# Altium project Main Board.PrjPcb
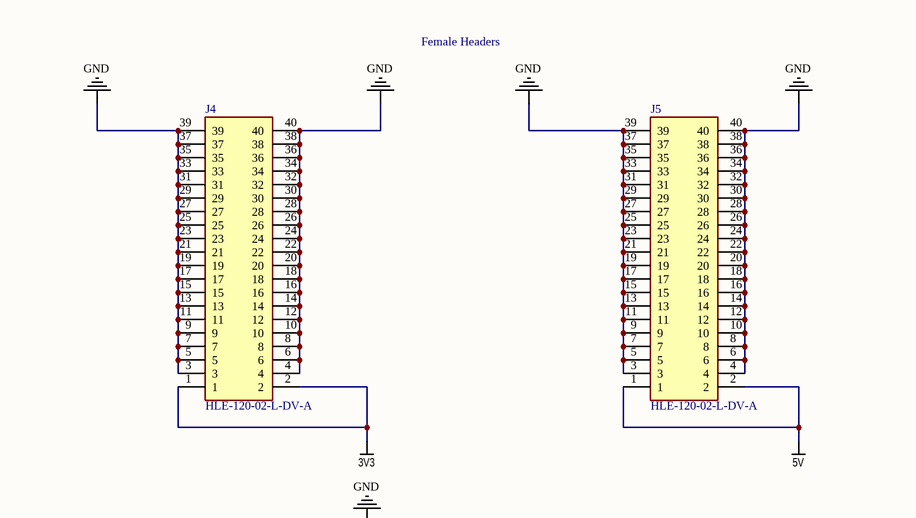
[diagram p0: MainBoard.SchDoc, top left]
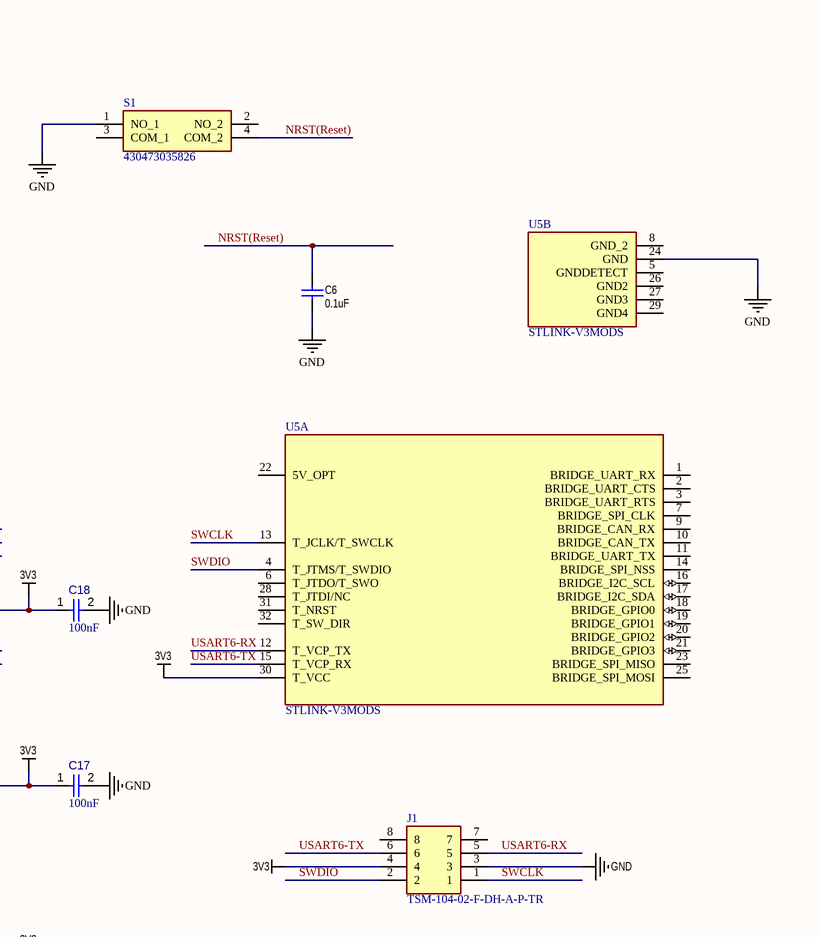
[diagram p1: MainBoard.SchDoc, top right]
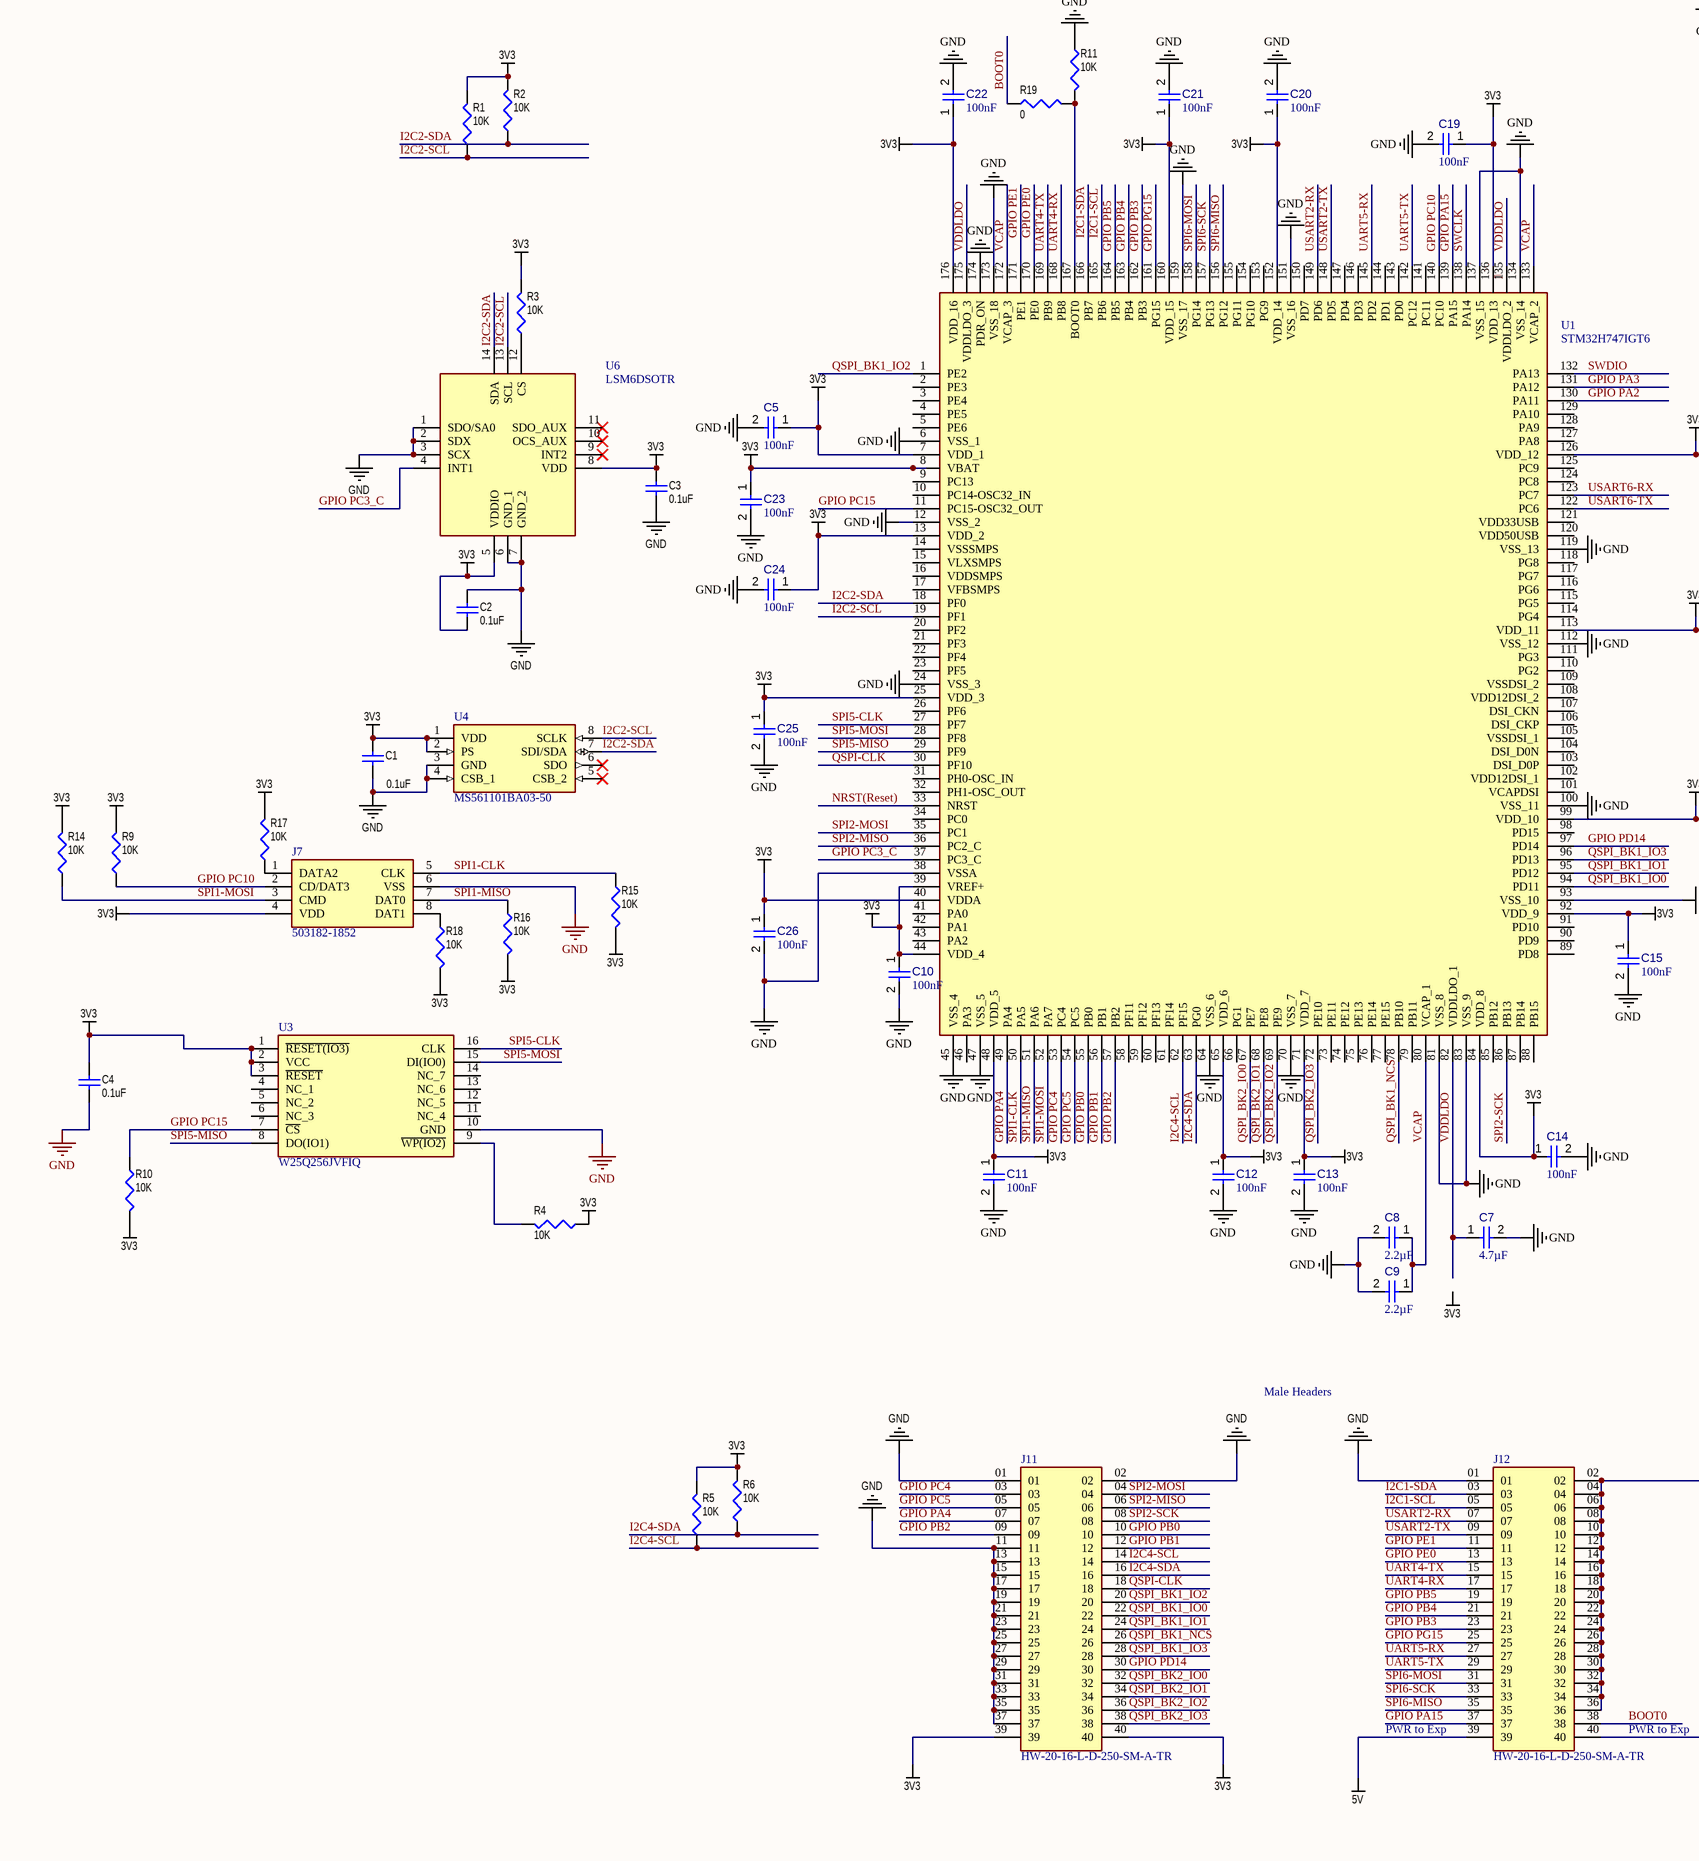
[diagram p2: MainBoard.SchDoc, bottom left]
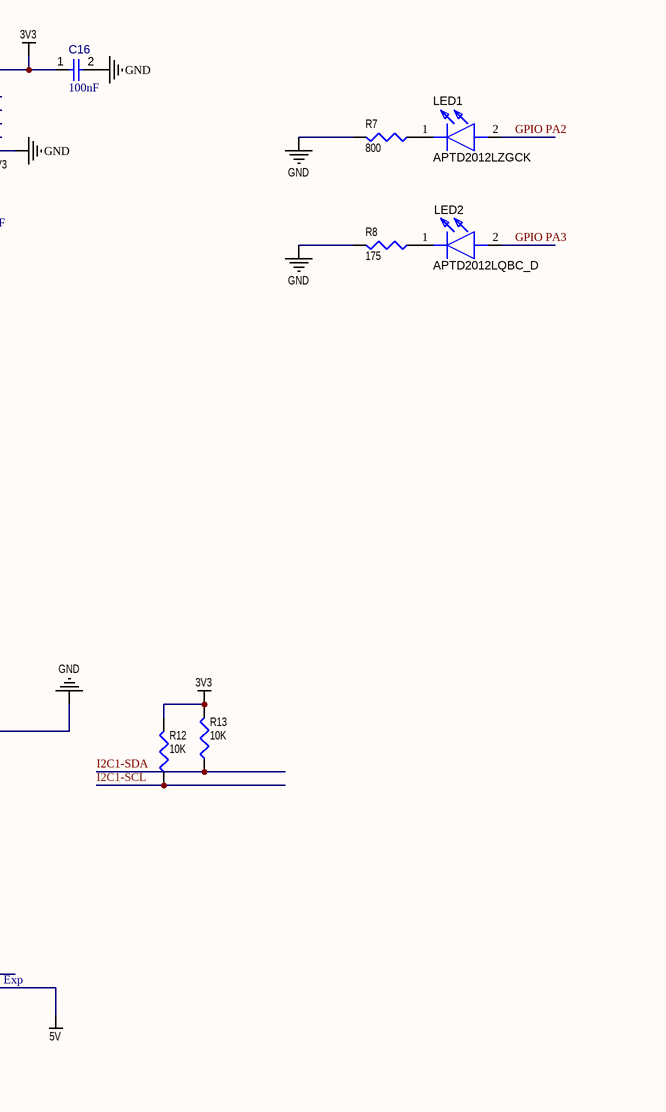
[diagram p3: MainBoard.SchDoc, bottom right]
1 sheet, 59 parts. Net scope: global (net labels, ports and power ports of the same name join across sheets).
Board file: MainBoardCurrent.PcbDoc

## Sheet MainBoard.SchDoc
size D; SheetNumber: 1; SheetTotal: 1

### Parts
C1  0.1uF  [1608[0603]]
C2  0.1uF  [1608[0603]]
C3  0.1uF  [1608[0603]]
C4  0.1uF  [1608[0603]]
C5  value 100nF  [CAPC0402(1005)60_L]  (hidden comment: Capacitor 100nF +/-20% 25V 0402)
C6  0.1uF  [1608[0603]]
C7  value 4.7µF  [CAPC0805(2012)145_L]  (hidden comment: Capacitor 4.7µF +/-40% 25V 0805)
C8  value 2.2µF  [CAPC0402(1005)60_L]  (hidden comment: Capacitor 2,2µF +/-20% 10V 0402)
C9  value 2.2µF  [CAPC0402(1005)60_L]  (hidden comment: Capacitor 2,2µF +/-20% 10V 0402)
C10  value 100nF  [CAPC0402(1005)60_L]  (hidden comment: Capacitor 100nF +/-20% 25V 0402)
C11  value 100nF  [CAPC0402(1005)60_L]  (hidden comment: Capacitor 100nF +/-20% 25V 0402)
C12  value 100nF  [CAPC0402(1005)60_L]  (hidden comment: Capacitor 100nF +/-20% 25V 0402)
C13  value 100nF  [CAPC0402(1005)60_L]  (hidden comment: Capacitor 100nF +/-20% 25V 0402)
C14  value 100nF  [CAPC0402(1005)60_L]  (hidden comment: Capacitor 100nF +/-20% 25V 0402)
C15  value 100nF  [CAPC0402(1005)60_L]  (hidden comment: Capacitor 100nF +/-20% 25V 0402)
C16  value 100nF  [CAPC0402(1005)60_L]  (hidden comment: Capacitor 100nF +/-20% 25V 0402)
C17  value 100nF  [CAPC0402(1005)60_L]  (hidden comment: Capacitor 100nF +/-20% 25V 0402)
C18  value 100nF  [CAPC0402(1005)60_L]  (hidden comment: Capacitor 100nF +/-20% 25V 0402)
C19  value 100nF  [CAPC0402(1005)60_L]  (hidden comment: Capacitor 100nF +/-20% 25V 0402)
C20  value 100nF  [CAPC0402(1005)60_L]  (hidden comment: Capacitor 100nF +/-20% 25V 0402)
C21  value 100nF  [CAPC0402(1005)60_L]  (hidden comment: Capacitor 100nF +/-20% 25V 0402)
C22  value 100nF  [CAPC0402(1005)60_L]  (hidden comment: Capacitor 100nF +/-20% 25V 0402)
C23  value 100nF  [CAPC0402(1005)60_L]  (hidden comment: Capacitor 100nF +/-20% 25V 0402)
C24  value 100nF  [CAPC0402(1005)60_L]  (hidden comment: Capacitor 100nF +/-20% 25V 0402)
C25  value 100nF  [CAPC0402(1005)60_L]  (hidden comment: Capacitor 100nF +/-20% 25V 0402)
C26  value 100nF  [CAPC0402(1005)60_L]  (hidden comment: Capacitor 100nF +/-20% 25V 0402)
J1  TSM-104-02-F-DH-A-P-TR  [TSM-104-ZZ-YYY-DH-A-P-TR]
J4  HLE-120-02-L-DV-A  [HLE-120-02-XXX-DV-A]
J5  HLE-120-02-L-DV-A  [HLE-120-02-XXX-DV-A]
J7  503182-1852  [5031821852]
J11  HW-20-16-L-D-250-SM-A-TR  [SAMTEC_HW-20-16-L-D-250-SM-A-TR]
J12  HW-20-16-L-D-250-SM-A-TR  [SAMTEC_HW-20-16-L-D-250-SM-A-TR]
LED1  APTD2012LZGCK  [FIL_0805J0500471MATE03]
LED2  APTD2012LQBC_D  [FIL_0805J0500471MATE03]
R1  10K  [J1-0603]
R2  10K  [J1-0603]
R3  10K  [J1-0603]
R4  10K  [J1-0603]
R5  10K  [J1-0603]
R6  10K  [J1-0603]
R7  800  [RES_ERJU03F6800V]
R8  175  [RES_ERJU03F6800V]
R9  10K  [J1-0603]
R10  10K  [J1-0603]
R11  10K  [J1-0603]
R12  10K  [J1-0603]
R13  10K  [J1-0603]
R14  10K  [J1-0603]
R15  10K  [J1-0603]
R16  10K  [J1-0603]
R17  10K  [J1-0603]
R18  10K  [J1-0603]
R19  0  [J1-0603]
S1  430473035826  [430473035826]
U1  STM32H747IGT6  [QFP50P2600X2600X160-176N]
U3  W25Q256JVFIQ  [SOIC127P1032X264-16N]
U4  MS561101BA03-50  [MS561101BA03-50]
U5  STLINK-V3MODS  [MODULE_STLINK-V3MODS]  (parts A,B of 2)
U6  LSM6DSOTR  [LGA-14(2.5X3X0.86)]

### Nets
3V3: C1.2 C2.1 C3.2 C4.2 C5.1 C10.1 C11.1 C12.1 C13.1 C14.1 C15.1 C16.1 C17.1 C18.1 C19.1 C20.1 C21.1 C22.1 C23.1 C24.1 C25.1 C26.1 J1.4 J4.1 J4.2 J7.4(VDD) J11.39 J11.40 R1.2 R2.2 R3.2 R4.1 R5.2 R6.2 R9.2 R10.2 R12.2 R13.2 R14.2 R15.2 R16.2 R17.2 R18.2 U1.7(VDD_1) U1.8(VBAT) U1.13(VDD_2) U1.25(VDD_3) U1.39(VREF+) U1.40(VDDA) U1.44(VDD_4) U1.48(VDD_5) U1.65(VDD_6) U1.71(VDD_7) U1.84(VDD_8) U1.92(VDD_9) U1.99(VDD_10) U1.113(VDD_11) U1.126(VDD_12) U1.136(VDD_13) U1.152(VDD_14) U1.160(VDD_15) U1.176(VDD_16) U3.1(~{RESET(IO3)}) U3.2(VCC) U3.3(~{RESET}) U4.1(VDD) U4.2(PS) U5.30(T_VCC) U6.5(VDDIO) U6.8(VDD)
5V: J5.1 J5.2 J12.39 J12.40
GND: C1.1 C2.2 C3.1 C4.1 C5.2 C6.1 C7.2 C8.2 C9.2 C10.2 C11.2 C12.2 C13.2 C14.2 C15.2 C16.2 C17.2 C18.2 C19.2 C20.2 C21.2 C22.2 C23.2 C24.2 C25.2 C26.2 J1.3 J4.3 J4.4 J4.5 J4.6 J4.7 J4.8 J4.9 J4.10 J4.11 J4.12 J4.13 J4.14 J4.15 J4.16 J4.17 J4.18 J4.19 J4.20 J4.21 J4.22 J4.23 J4.24 J4.25 J4.26 J4.27 J4.28 J4.29 J4.30 J4.31 J4.32 J4.33 J4.34 J4.35 J4.36 J4.37 J4.38 J4.39 J4.40 J5.3 J5.4 J5.5 J5.6 J5.7 J5.8 J5.9 J5.10 J5.11 J5.12 J5.13 J5.14 J5.15 J5.16 J5.17 J5.18 J5.19 J5.20 J5.21 J5.22 J5.23 J5.24 J5.25 J5.26 J5.27 J5.28 J5.29 J5.30 J5.31 J5.32 J5.33 J5.34 J5.35 J5.36 J5.37 J5.38 J5.39 J5.40 J7.6(VSS) J11.01 J11.02 J11.11 J11.13 J11.15 J11.17 J11.19 J11.21 J11.23 J11.25 J11.27 J11.29 J11.31 J11.33 J11.35 J11.37 J12.01 J12.02 J12.04 J12.06 J12.08 J12.10 J12.12 J12.14 J12.16 J12.18 J12.20 J12.22 J12.24 J12.26 J12.28 J12.30 J12.32 J12.34 J12.36 R7.2 R8.2 R11.1 S1.1(NO_1) U1.6(VSS_1) U1.12(VSS_2) U1.24(VSS_3) U1.38(VSSA) U1.45(VSS_4) U1.47(VSS_5) U1.64(VSS_6) U1.70(VSS_7) U1.81(VSS_8) U1.83(VSS_9) U1.93(VSS_10) U1.100(VSS_11) U1.112(VSS_12) U1.119(VSS_13) U1.134(VSS_14) U1.137(VSS_15) U1.151(VSS_16) U1.159(VSS_17) U1.173(VSS_18) U1.174(PDR_ON) U3.10(GND) U4.3(GND) U4.4(CSB_1) U5.24(GND) U6.1(SDO/SA0) U6.2(SDX) U6.3(SCX) U6.6(GND_1) U6.7(GND_2)
BOOT0: J12.38 R19.1
GPIO PA2: LED1.2(A) U1.130(PA11)
GPIO PA3: LED2.2(A) U1.131(PA12)
GPIO PA4: J11.07 U1.49(PA4)
GPIO PA15: J12.37 U1.139(PA15)
GPIO PB0: J11.10 U1.55(PB0)
GPIO PB1: J11.12 U1.56(PB1)
GPIO PB2: J11.09 U1.57(PB2)
GPIO PB3: J12.23 U1.162(PB3)
GPIO PB4: J12.21 U1.163(PB4)
GPIO PB5: J12.19 U1.164(PB5)
GPIO PC3_C: U1.37(PC3_C) U6.4(INT1)
GPIO PC4: J11.03 U1.53(PC4)
GPIO PC5: J11.05 U1.54(PC5)
GPIO PC10: J7.2(CD/DAT3) R9.1 U1.140(PC10)
GPIO PC15: R10.1 U1.11(PC15-OSC32_OUT) U3.7(~{CS})
GPIO PD14: J11.30 U1.97(PD14)
GPIO PE0: J12.13 U1.170(PE0)
GPIO PE1: J12.11 U1.171(PE1)
GPIO PG15: J12.25 U1.161(PG15)
I2C1-SCL: J12.05 R12.1 U1.165(PB6)
I2C1-SDA: J12.03 R13.1 U1.166(PB7)
I2C2-SCL: R1.1 U1.19(PF1) U4.8(SCLK) U6.13(SCL)
I2C2-SDA: R2.1 U1.18(PF0) U4.7(SDI/SDA) U6.14(SDA)
I2C4-SCL: J11.14 R5.1 U1.62(PF15)
I2C4-SDA: J11.16 R6.1 U1.63(PG0)
NRST(Reset): C6.2 S1.4(COM_2) U1.33(NRST)
QSPI-CLK: J11.18 U1.30(PF10)
QSPI_BK1_IO0: J11.22 U1.94(PD11)
QSPI_BK1_IO1: J11.24 U1.95(PD12)
QSPI_BK1_IO2: J11.20 U1.1(PE2)
QSPI_BK1_IO3: J11.28 U1.96(PD13)
QSPI_BK1_NCS: J11.26 U1.78(PB10)
QSPI_BK2_IO0: J11.32 U1.67(PE7)
QSPI_BK2_IO1: J11.34 U1.68(PE8)
QSPI_BK2_IO2: J11.36 U1.69(PE9)
QSPI_BK2_IO3: J11.38 U1.72(PE10)
SPI1-CLK: J7.5(CLK) R15.1 U1.50(PA5)
SPI1-MISO: J7.7(DAT0) R16.1 U1.51(PA6)
SPI1-MOSI: J7.3(CMD) R14.1 U1.52(PA7)
SPI2-MISO: J11.06 U1.36(PC2_C)
SPI2-MOSI: J11.04 U1.35(PC1)
SPI2-SCK: J11.08 U1.86(PB13)
SPI5-CLK: U1.27(PF7) U3.16(CLK)
SPI5-MISO: U1.29(PF9) U3.8(DO(IO1))
SPI5-MOSI: U1.28(PF8) U3.15(DI(IO0))
SPI6-MISO: J12.35 U1.156(PG12)
SPI6-MOSI: J12.31 U1.158(PG14)
SPI6-SCK: J12.33 U1.157(PG13)
SWCLK: J1.1 U1.138(PA14) U5.13(T_JCLK/T_SWCLK)
SWDIO: J1.2 U1.132(PA13) U5.4(T_JTMS/T_SWDIO)
UART4-RX: J12.17 U1.168(PB8)
UART4-TX: J12.15 U1.169(PB9)
UART5-RX: J12.27 U1.145(PD2)
UART5-TX: J12.29 U1.142(PC12)
USART2-RX: J12.07 U1.149(PD6)
USART2-TX: J12.09 U1.148(PD5)
USART6-RX: J1.5 U1.123(PC7) U5.12(T_VCP_TX)
USART6-TX: J1.6 U1.122(PC6) U5.15(T_VCP_RX)
VCAP: C8.1 C9.1 U1.80(VCAP_1) U1.133(VCAP_2) U1.172(VCAP_3)
VDDLDO: C7.1 U1.82(VDDLDO_1) U1.135(VDDLDO_2) U1.175(VDDLDO_3)
NetJ7_1: J7.1(DATA2) R17.1
NetJ7_8: J7.8(DAT1) R18.1
NetLED1_1: LED1.1(K) R7.1
NetLED2_1: LED2.1(K) R8.1
NetR3_1: R3.1 U6.12(CS)
NetR4_2: R4.2 U3.9(~{WP(IO2)})
NetR11_2: R11.2 R19.2 U1.167(BOOT0)

Not connected (* = marked no-connect by the designer): J1 7 8; S1 2(NO_2) 3(COM_1); U1 2(PE3) 3(PE4) 4(PE5) 5(PE6) 9(PC13) 10(PC14-OSC32_IN) 14(VSSSMPS) 15(VLXSMPS) 16(VDDSMPS) 17(VFBSMPS) 20(PF2) 21(PF3) 22(PF4) 23(PF5) 26(PF6) 31(PH0-OSC_IN) 32(PH1-OSC_OUT) 34(PC0) 41(PA0) 42(PA1) 43(PA2) 46(PA3) 58(PF11) 59(PF12) 60(PF13) 61(PF14) 66(PG1) 73(PE11) 74(PE12) 75(PE13) 76(PE14) 77(PE15) 79(PB11) 85(PB12) 87(PB14) 88(PB15) 89(PD8) 90(PD9) 91(PD10) 98(PD15) 101(VCAPDSI) 102(VDD12DSI_1) 103(DSI_D0P) 104(DSI_D0N) 105(VSSDSI_1) 106(DSI_CKP) 107(DSI_CKN) 108(VDD12DSI_2) 109(VSSDSI_2) 110(PG2) 111(PG3) 114(PG4) 115(PG5) 116(PG6) 117(PG7) 118(PG8) 120(VDD50USB) 121(VDD33USB) 124(PC8) 125(PC9) 127(PA8) 128(PA9) 129(PA10) 141(PC11) 143(PD0) 144(PD1) 146(PD3) 147(PD4) 150(PD7) 153(PG9) 154(PG10) 155(PG11); U3 4(NC_1) 5(NC_2) 6(NC_3) 11(NC_4) 12(NC_5) 13(NC_6) 14(NC_7); U4 5(CSB_2)* 6(SDO)*; U5 1(BRIDGE_UART_RX) 2(BRIDGE_UART_CTS) 3(BRIDGE_UART_RTS) 5(GNDDETECT) 6(T_JTDO/T_SWO) 7(BRIDGE_SPI_CLK) 8(GND_2) 9(BRIDGE_CAN_RX) 10(BRIDGE_CAN_TX) 11(BRIDGE_UART_TX) 14(BRIDGE_SPI_NSS) 16(BRIDGE_I2C_SCL) 17(BRIDGE_I2C_SDA) 18(BRIDGE_GPIO0) 19(BRIDGE_GPIO1) 20(BRIDGE_GPIO2) 21(BRIDGE_GPIO3) 22(5V_OPT) 23(BRIDGE_SPI_MISO) 25(BRIDGE_SPI_MOSI) 26(GND2) 27(GND3) 28(T_JTDI/NC) 29(GND4) 31(T_NRST) 32(T_SW_DIR); U6 9(INT2)* 10(OCS_AUX)* 11(SDO_AUX)*

### Notes on the sheet
- Female Headers
- Male Headers
- (near J12) PWR to Exp
- PWR to Exp
- Labels drawn without touching a wire or pin: 3V3, 

### Library data of the parts
C1-C4 C6 = Cap: Capacitor; Published: 8-Jun-2000; LatestRevisionDate: 17-Jul-2002; LatestRevisionNote: Re-released for DXP Platform.; PackageReference: RAD-0.3; Publisher: Altium Limited; PackageDescription: Radial Cap, Thru-Hole; 2 Leads; 0.3 in Pin Spacing; Value: 0.1uF
C5 C10-C26 = CMP-001-00065-4: Chip Capacitor, 100nF +/-20%, 25V, 0402, Thickness 0.6 mm; Tolerance: 10%; Max Operating Temperature: 85°C; Min Operating Temperature: -55°C; Pins: 2; Voltage Rating: 25V; Mounting Technology: SMT; Case/Package: 0402
C7 = CMP-001-00080-4: Chip Capacitor, 4.7µF +/-40%, 25V, 0805, Thickness 1.45 mm; Tolerance: 20%; Voltage Rating: 25V; Min Operating Temperature: -55°C; Max Operating Temperature: 85°C; Pins: 2; Mounting Technology: SMT; Case/Package: 0805
C8 C9 = CMP-001-00056-4: Chip Capacitor, 2,2µF +/-20%, 10V, 0402, Thickness 0.6 mm; Tolerance: 10%; Mounting Technology: SMT; Max Operating Temperature: 85°C; Case/Package: 0402; Pins: 2; Min Operating Temperature: -55°C; Voltage Rating: 10V
J1 = TSM-104-02-F-DH-A-P-TR: Connector; Manufacturer_Name: SAMTEC; Datasheet Link: http://suddendocs.samtec.com/prints/tsm-1xx-xx-xxx-xx-xx-xxx-xx-mkt1.pdf; Manufacturer_Part_Number: TSM-104-02-F-DH-A-P-TR
J4 J5 = HLE-120-02-L-DV-A: Connector; Manufacturer_Name: SAMTEC; Datasheet Link: http://suddendocs.samtec.com/prints/hle-1xx-02-xxx-dv-xx-xx-xx-mkt.pdf; Manufacturer_Part_Number: HLE-120-02-L-DV-A; Mouser Part Number: 200-HLE12002LDVA; Mouser Price/Stock: https://www.mouser.co.uk/ProductDetail/Samtec/HLE-120-02-L-DV-A?qs=0lQeLiL1qyZq0rwGrAI%2FeQ%3D%3D; Arrow Part Number: HLE-120-02-L-DV-A; Arrow Price/Stock: https://www.arrow.com/en/products/hle-120-02-l-dv-a/samtec?region=nac
J7 = 503182-1852: Connector; Manufacturer_Name: Molex; Datasheet Link: https://www.molex.com/pdm_docs/sd/5031821852_sd.pdf; Manufacturer_Part_Number: 503182-1852; Mouser Part Number: 538-503182-1852; Mouser Price/Stock: https://www.mouser.co.uk/ProductDetail/Molex/503182-1852?qs=s7UCm7gO1bZmpyAhCKZ26g%3D%3D
LED1 = APTD2012LZGCK: LED; Manufacturer_Name: Kingbright; Datasheet Link: http://www.kingbrightusa.com/images/catalog/SPEC/APTD2012LZGCK.pdf; Height: 1.05mm; Manufacturer_Part_Number: APTD2012LZGCK; Mouser Part Number: 604-APTD2012LZGCK; Mouser Price/Stock: https://www.mouser.co.uk/ProductDetail/Kingbright/APTD2012LZGCK?qs=AQlKX63v8RvUnlqpSGhMeA%3D%3D; Arrow Part Number: APTD2012LZGCK; Arrow Price/Stock: https://www.arrow.com/en/products/aptd2012lzgck/kingbright?region=nac
LED2 = APTD2012LQBC_D: LED; Manufacturer_Name: Kingbright; Manufacturer_Part_Number: APTD2012LQBC/D; Datasheet Link: https://componentsearchengine.com/Datasheets/1/APTD2012LQBC_D.pdf; Height: 1.2mm; Mouser Part Number: 604-APTD2012LQBCD; Mouser Price/Stock: https://www.mouser.co.uk/ProductDetail/Kingbright/APTD2012LQBC-D?qs=AQlKX63v8RvDGqprk6aUCg%3D%3D; Arrow Part Number: APTD2012LQBC/D; Arrow Price/Stock: https://www.arrow.com/en/products/aptd2012lqbcd/kingbright
R1-R19 = Res3: Resistor; Value: 1K; Published: 8-Jun-2000; LatestRevisionDate: 29-May-2009; LatestRevisionNote: IPC-7351 Footprint Added.; PackageReference: J1-0603; Publisher: Altium Limited; PackageDescription: Chip Resistor
S1 = 430473035826: Switch; Manufacturer_Name: Wurth Elektronik; Datasheet Link: https://componentsearchengine.com/Datasheets/2/430473035826.pdf; Height: 3.7mm; Manufacturer_Part_Number: 430473035826; Mouser Part Number: 710-430473035826; Mouser Price/Stock: https://www.mouser.co.uk/ProductDetail/Wurth-Elektronik/430473035826?qs=wr8lucFkNMX7XPiy2wLoYQ%3D%3D
U1 = STM32H747IGT6: ARM Microcontrollers - MCU 16/32-BITS MICROS; Manufacturer_Name: STMicroelectronics; Geometry.Height: 1.6mm; Manufacturer_Part_Number: STM32H747IGT6; Mouser Part Number: 511-STM32H747IGT6; Mouser Price/Stock: https://www.mouser.co.uk/ProductDetail/STMicroelectronics/STM32H747IGT6?qs=%252B6g0mu59x7Kw%252BsPEalqvLg%3D%3D; Arrow Part Number: STM32H747IGT6; Arrow Price/Stock: https://www.arrow.com/en/products/stm32h747igt6/stmicroelectronics?region=nac; Datasheet Link: https://www.mouser.com/datasheet/2/389/dm00602212-1799407.pdf
U3 = W25Q256JVFIQ: Integrated Circuit; Manufacturer_Name: Winbond; Datasheet Link: https://www.winbond.com/hq/search-resource-file.jsp?partNo=W25Q256JVFIQ&type=datasheet; Height: 2.64mm; Manufacturer_Part_Number: W25Q256JVFIQ; Mouser Part Number: 454-W25Q256JVFIQ; Mouser Price/Stock: https://www.mouser.co.uk/ProductDetail/Winbond/W25Q256JVFIQ?qs=qSfuJ%252Bfl%2Fd66Mf%2FmOCw4Wg%3D%3D; Arrow Part Number: W25Q256JVFIQ; Arrow Price/Stock: https://www.arrow.com/en/products/w25q256jvfiq/winbond-electronics?region=nac
U4 = MS561101BA03-50: Integrated Circuit; Manufacturer_Name: TE Connectivity; Datasheet Link: http://www.te.com/usa-en/search.html?q=ms5611&source=header; Manufacturer_Part_Number: MS561101BA03-50; Mouser Part Number: 824-MS561101BA03-50; Mouser Price/Stock: https://www.mouser.co.uk/ProductDetail/Measurement-Specialties/MS561101BA03-50?qs=%252BgKeJhng5iV%252BnCz6Qd5iDw%3D%3D; Arrow Part Number: MS561101BA03-50; Arrow Price/Stock: https://www.arrow.com/en/products/ms561101ba03-50/te-connectivity?region=nac
U5 = CMP-005-000000-1: Availability: Unavailable; MP: STLINK-V3MODS; Design Item ID: STLINK-V3MODS; Value: *; Package: None; Pin Count: 32; Source: STLINK-V3MODS.SchLib; Component Type: Standard; Price: None
U6 = LSM6DSOTR: Accelerometer; Manufacturer_Name: STMicroelectronics; Datasheet Link: https://www.st.com/resource/en/datasheet/lsm6dso.pdf; Manufacturer_Part_Number: LSM6DSOTR; Mouser Part Number: 511-LSM6DSOTR; Mouser Price/Stock: https://www.mouser.co.uk/ProductDetail/STMicroelectronics/LSM6DSOTR?qs=lc2O%252BfHJPVbD197C5c7oNw%3D%3D; Arrow Part Number: LSM6DSOTR; Arrow Price/Stock: https://www.arrow.com/en/products/lsm6dsotr/stmicroelectronics?region=nac
J11 J12 = HW-20-16-L-D-250-SM-A-TR: Package: None; Price: None; Value: *; MP: HW-20-16-L-D-250-SM-A-TR; Availability: Unavailable